# Altium project M.2 Accelerator.PrjPcb (part 2 of 2)

## Sheet 6_DRAMBanks.SchDoc: DRAM Signals (Banks 34-35)
size Legal; Date: 12/28/2025; Author: Praveen Perera; DrawnBy: Praveen Perera; Engineer: Praveen Perera; Revision: 1; SheetNumber: 6; SheetTotal: 9
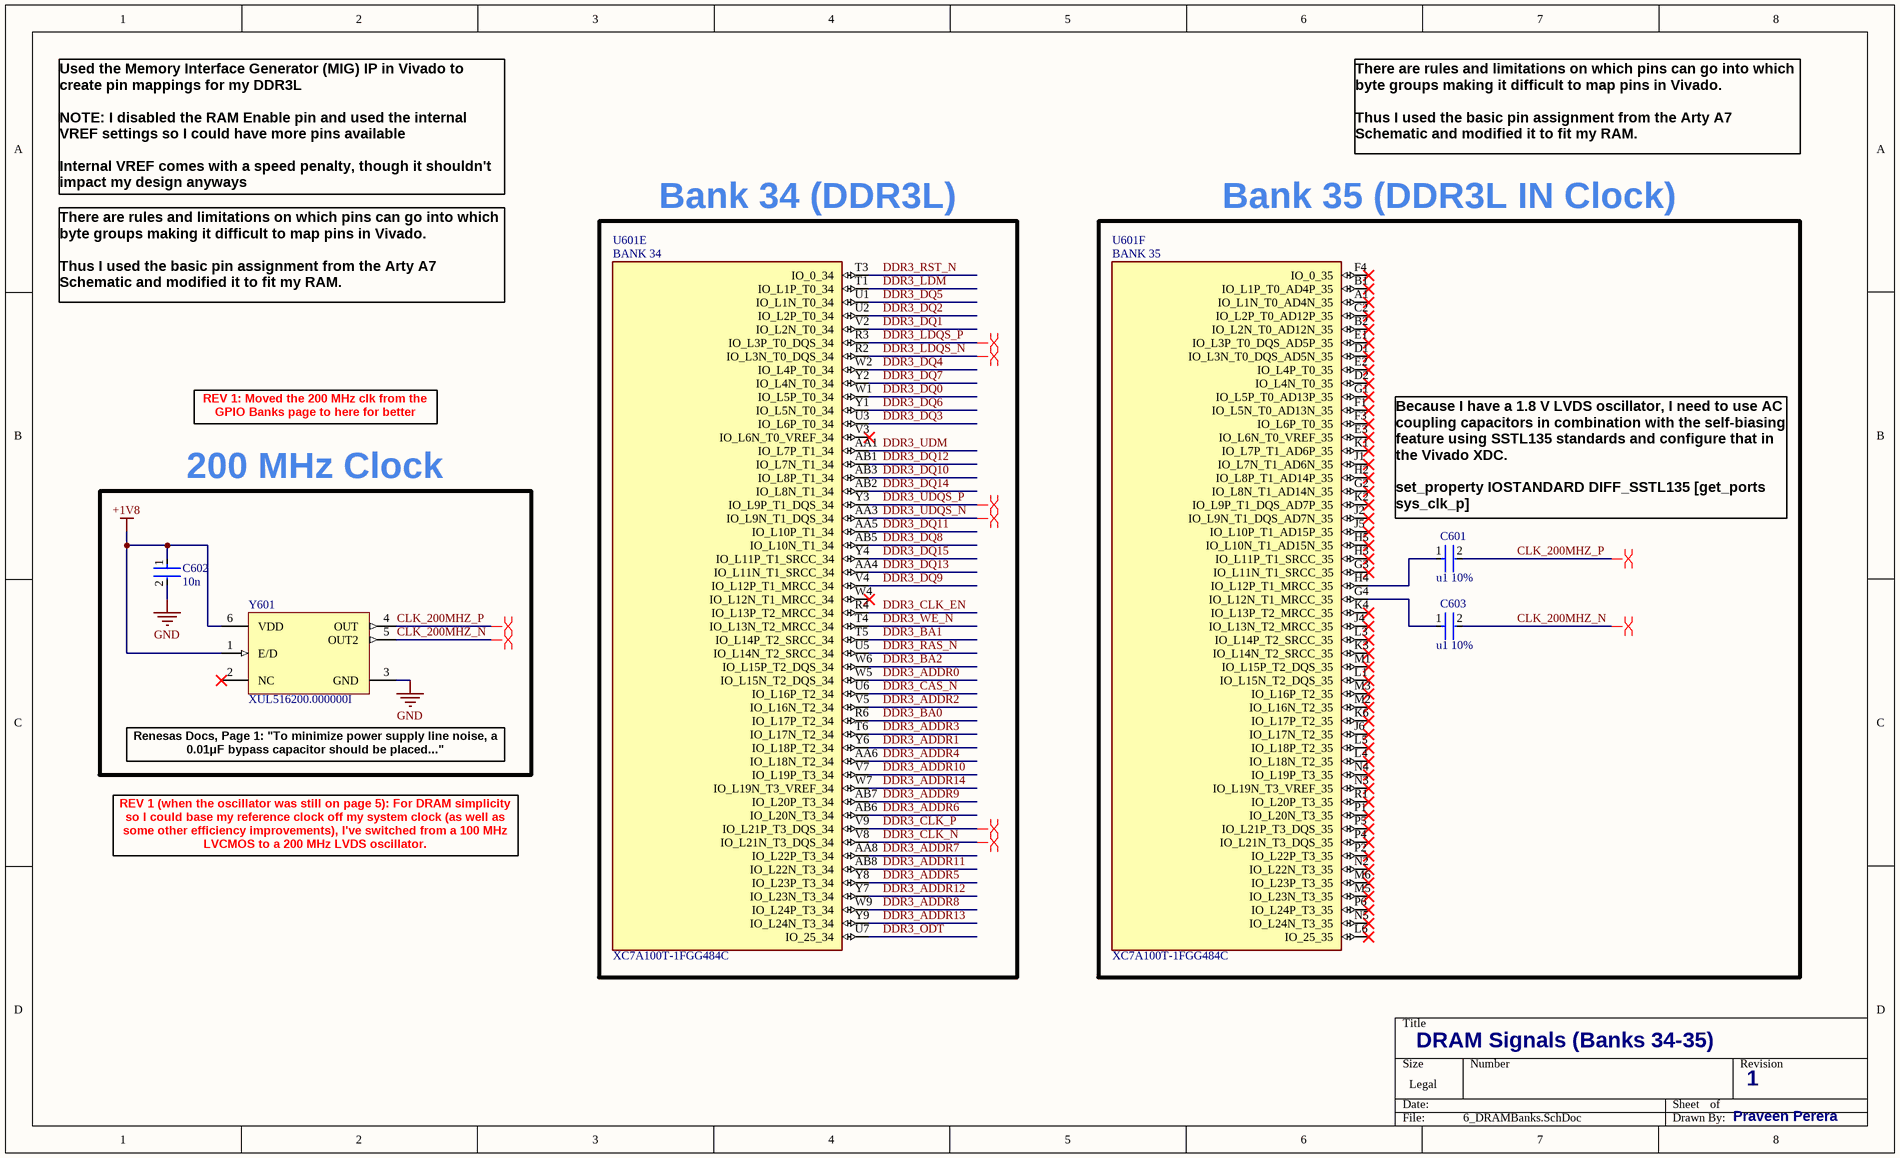
[diagram p5: 6_DRAMBanks.SchDoc]

### Parts
C601  u1 10%  [FP-CL891-IPC_C]
C602  10n  [FP-GCM155-0_05-IPC_C]
C603  u1 10%  [FP-CL891-IPC_C]
U601  XC7A100T-1FGG484C  [BGA484C100P22X22_2300X2300X260N]  (parts E,F of 14)
Y601  XUL516200.000000I  [JS6_MFG]

### Nets
+1V8: C602.1 Y601.1(E/D) Y601.6(VDD)
GND: C602.2 Y601.3(GND)  [project net BUCK_1V_EPAD]
CLK_200MHZ_N: C603.2 Y601.5(OUT2)
CLK_200MHZ_P: C601.2 Y601.4(OUT)
DDR3_ADDR0: U601.W5(IO_L15N_T2_DQS_34)
DDR3_ADDR1: U601.Y6(IO_L18P_T2_34)
DDR3_ADDR2: U601.V5(IO_L16N_T2_34)
DDR3_ADDR3: U601.T6(IO_L17N_T2_34)
DDR3_ADDR4: U601.AA6(IO_L18N_T2_34)
DDR3_ADDR5: U601.Y8(IO_L23P_T3_34)
DDR3_ADDR6: U601.AB6(IO_L20N_T3_34)
DDR3_ADDR7: U601.AA8(IO_L22P_T3_34)
DDR3_ADDR8: U601.W9(IO_L24P_T3_34)
DDR3_ADDR9: U601.AB7(IO_L20P_T3_34)
DDR3_ADDR10: U601.V7(IO_L19P_T3_34)
DDR3_ADDR11: U601.AB8(IO_L22N_T3_34)
DDR3_ADDR12: U601.Y7(IO_L23N_T3_34)
DDR3_ADDR13: U601.Y9(IO_L24N_T3_34)
DDR3_ADDR14: U601.W7(IO_L19N_T3_VREF_34)
DDR3_BA0: U601.R6(IO_L17P_T2_34)
DDR3_BA1: U601.T5(IO_L14P_T2_SRCC_34)
DDR3_BA2: U601.W6(IO_L15P_T2_DQS_34)
DDR3_CAS_N: U601.U6(IO_L16P_T2_34)
DDR3_CLK_EN: U601.R4(IO_L13P_T2_MRCC_34)
DDR3_CLK_N: U601.V8(IO_L21N_T3_DQS_34)
DDR3_CLK_P: U601.V9(IO_L21P_T3_DQS_34)
DDR3_DQ0: U601.W1(IO_L5P_T0_34)
DDR3_DQ1: U601.V2(IO_L2N_T0_34)
DDR3_DQ2: U601.U2(IO_L2P_T0_34)
DDR3_DQ3: U601.U3(IO_L6P_T0_34)
DDR3_DQ4: U601.W2(IO_L4P_T0_34)
DDR3_DQ5: U601.U1(IO_L1N_T0_34)
DDR3_DQ6: U601.Y1(IO_L5N_T0_34)
DDR3_DQ7: U601.Y2(IO_L4N_T0_34)
DDR3_DQ8: U601.AB5(IO_L10N_T1_34)
DDR3_DQ9: U601.V4(IO_L12P_T1_MRCC_34)
DDR3_DQ10: U601.AB3(IO_L8P_T1_34)
DDR3_DQ11: U601.AA5(IO_L10P_T1_34)
DDR3_DQ12: U601.AB1(IO_L7N_T1_34)
DDR3_DQ13: U601.AA4(IO_L11N_T1_SRCC_34)
DDR3_DQ14: U601.AB2(IO_L8N_T1_34)
DDR3_DQ15: U601.Y4(IO_L11P_T1_SRCC_34)
DDR3_LDM: U601.T1(IO_L1P_T0_34)
DDR3_LDQS_N: U601.R2(IO_L3N_T0_DQS_34)
DDR3_LDQS_P: U601.R3(IO_L3P_T0_DQS_34)
DDR3_ODT: U601.U7(IO_25_34)
DDR3_RAS_N: U601.U5(IO_L14N_T2_SRCC_34)
DDR3_RST_N: U601.T3(IO_0_34)
DDR3_UDM: U601.AA1(IO_L7P_T1_34)
DDR3_UDQS_N: U601.AA3(IO_L9N_T1_DQS_34)
DDR3_UDQS_P: U601.Y3(IO_L9P_T1_DQS_34)
DDR3_WE_N: U601.T4(IO_L13N_T2_MRCC_34)
NetC601_1: C601.1 U601.H4(IO_L12P_T1_MRCC_35)
NetC603_1: C603.1 U601.G4(IO_L12N_T1_MRCC_35)

Not connected (* = marked no-connect by the designer): U601 A1(IO_L1N_T0_AD4N_35)* B1(IO_L1P_T0_AD4P_35)* B2(IO_L2N_T0_AD12N_35)* C2(IO_L2P_T0_AD12P_35)* D1(IO_L3N_T0_DQS_AD5N_35)* D2(IO_L4N_T0_35)* E1(IO_L3P_T0_DQS_AD5P_35)* E2(IO_L4P_T0_35)* E3(IO_L6N_T0_VREF_35)* F1(IO_L5N_T0_AD13N_35)* F3(IO_L6P_T0_35)* F4(IO_0_35)* G1(IO_L5P_T0_AD13P_35)* G2(IO_L8N_T1_AD14N_35)* G3(IO_L11N_T1_SRCC_35)* H2(IO_L8P_T1_AD14P_35)* H3(IO_L11P_T1_SRCC_35)* H5(IO_L10N_T1_AD15N_35)* J1(IO_L7N_T1_AD6N_35)* J2(IO_L9N_T1_DQS_AD7N_35)* J4(IO_L13N_T2_MRCC_35)* J5(IO_L10P_T1_AD15P_35)* J6(IO_L17N_T2_35)* K1(IO_L7P_T1_AD6P_35)* K2(IO_L9P_T1_DQS_AD7P_35)* K3(IO_L14N_T2_SRCC_35)* K4(IO_L13P_T2_MRCC_35)* K6(IO_L17P_T2_35)* L1(IO_L15N_T2_DQS_35)* L3(IO_L14P_T2_SRCC_35)* L4(IO_L18N_T2_35)* L5(IO_L18P_T2_35)* L6(IO_25_35)* M1(IO_L15P_T2_DQS_35)* M2(IO_L16N_T2_35)* M3(IO_L16P_T2_35)* M5(IO_L23N_T3_35)* M6(IO_L23P_T3_35)* N2(IO_L22N_T3_35)* N3(IO_L19N_T3_VREF_35)* N4(IO_L19P_T3_35)* N5(IO_L24N_T3_35)* P1(IO_L20N_T3_35)* P2(IO_L22P_T3_35)* P4(IO_L21N_T3_DQS_35)* P5(IO_L21P_T3_DQS_35)* P6(IO_L24P_T3_35)* R1(IO_L20P_T3_35)* V3(IO_L6N_T0_VREF_34)* W4(IO_L12N_T1_MRCC_34)*; Y601 2(NC)*

### Layout directives
differential pair: CLK_200MHZ_N, CLK_200MHZ_P, DDR3_CLK_N, DDR3_CLK_P, DDR3_LDQS_N, DDR3_LDQS_P, DDR3_UDQS_N, DDR3_UDQS_P

### Notes on the sheet
- There are rules and limitations on which pins can go into which byte groups making it difficult to map pins in Vivado.
  Thus I used the basic pin assignment from the Arty A7 Schematic and modified it to fit my RAM.
- Used the Memory Interface Generator (MIG) IP in Vivado to create pin mappings for my DDR3L
  NOTE: I disabled the RAM Enable pin and used the internal VREF settings so I could have more pins available
  Internal VREF comes with a speed penalty, though it shouldn't impact my design anyways
- Bank 34 (DDR3L)
- Bank 35 (DDR3L IN Clock)
- REV 1: Moved the 200 MHz clk from the GPIO Banks page to here for better organization.
- 200 MHz Clock
- Because I have a 1.8 V LVDS oscillator, I need to use AC coupling capacitors in combination with the self-biasing feature using SSTL135 standards and configure that in the Vivado XDC.
  set_property IOSTANDARD DIFF_SSTL135 [get_ports sys_clk_p]
  set_property DIFF_TERM TRUE [get_ports sys_clk_p]
- (near Y601) Renesas Docs, Page 1: "To minimize power supply line noise, a 0.01μF bypass capacitor should be placed..."
- REV 1 (when the oscillator was still on page 5): For DRAM simplicity so I could base my reference clock off my system clock (as well as some other efficiency improvements), I've switched from a 100 MHz LVCMOS to a 200 MHz LVDS oscillator.
- (in symbol XC7A100T-1FGG484C, part E) BANK 34
- (in symbol XC7A100T-1FGG484C, part F) BANK 35

### Library data of the parts
C601 C603 = CMP-13271-001945-1: as C303 on sheet 3_PowerDistribution
C602 = CMP-2008-03715-2: GCM155R71E103KA37D / Ceramic Capacitor for Automotive 10nF ±10% 25VDC X7R 0402 Paper T/R; Voltage Rating (DC): 25V; Packaging: Tape and Reel; Case/Package: 0402; Max Operating Temperature: 125°C; Radiation Hardening: No; Case Code (Metric): 1005; Termination: SMD/SMT; Mount: Surface Mount; Voltage: 25V; Width: 0.02inch; Dielectric: X7R; Height: 0.5mm; Depth: 0.5mm; Length: 1mm; Package Quantity: 1; Thickness: 0.022inch; Voltage Rating: 25V; Case Code (Imperial): 0402; Ratings: AEC-Q200; Capacitance: 10nF; REACH SVHC: No SVHC; Lead Free: Lead Free; Min Operating Temperature: -55°C; Tolerance: 10%
U601 = XC7A100T-1FGG484C: Artix-7 Field Programmable Gate Array (FPGA) IC 285 4976640 101440 484-BBGA; MF: Xilinx Inc.; Value: *; Check_prices: https://www.snapeda.com/parts/XC7A100T-1FGG484C/Xilinx/view-part/?ref=eda; MP: XC7A100T-1FGG484C; SnapEDA_Link: https://www.snapeda.com/parts/XC7A100T-1FGG484C/Xilinx/view-part/?ref=snap; Package: FBGA-484 Xilinx
Y601 = CMP-00572-107107086-3: Crystal Oscillator 200MHz LVDS 1.8VDC ±25ppm ‐40 to +85°C 4-Pin SMD 5x3.2mm Cut Tape; Min Input Voltage: 1.71V; Max Output Frequency: 999.9MHz; Max Input Voltage: 1.89V; ComponentLink1URL: http://www.renesas.com; ComponentLink2URL: https://octopart.com/cad-content/api/get-model-datasheet/15189/107107086; HelpURL: https://octopart.com/cad-content/api/get-model-datasheet/15189/107107086; ComponentLink3Description: Manufacturer's Package Drawing; Mount: Surface Mount; Number of Pins: 6; Min Operating Temperature: -40°C; Case/Package: CLCC; Height: 1.2mm; ComponentLink2Description: Datasheet URL; ComponentLink1Description: Manufacturer's Website; ComponentLink3URL: https://www.renesas.com/en/document/psc/js6-package-outline-50-x-32-mm-body-11-mm-thick; Max Operating Temperature: 85°C; RoHS: Compliant; Output Type: LVDS

## Sheet 7_DDR3L.SchDoc: DDR3L Configuration
size Legal; Date: 12/28/2025; Author: Praveen Perera; DrawnBy: Praveen Perera; Engineer: Praveen Perera; Revision: 0; SheetNumber: 7; SheetTotal: 9
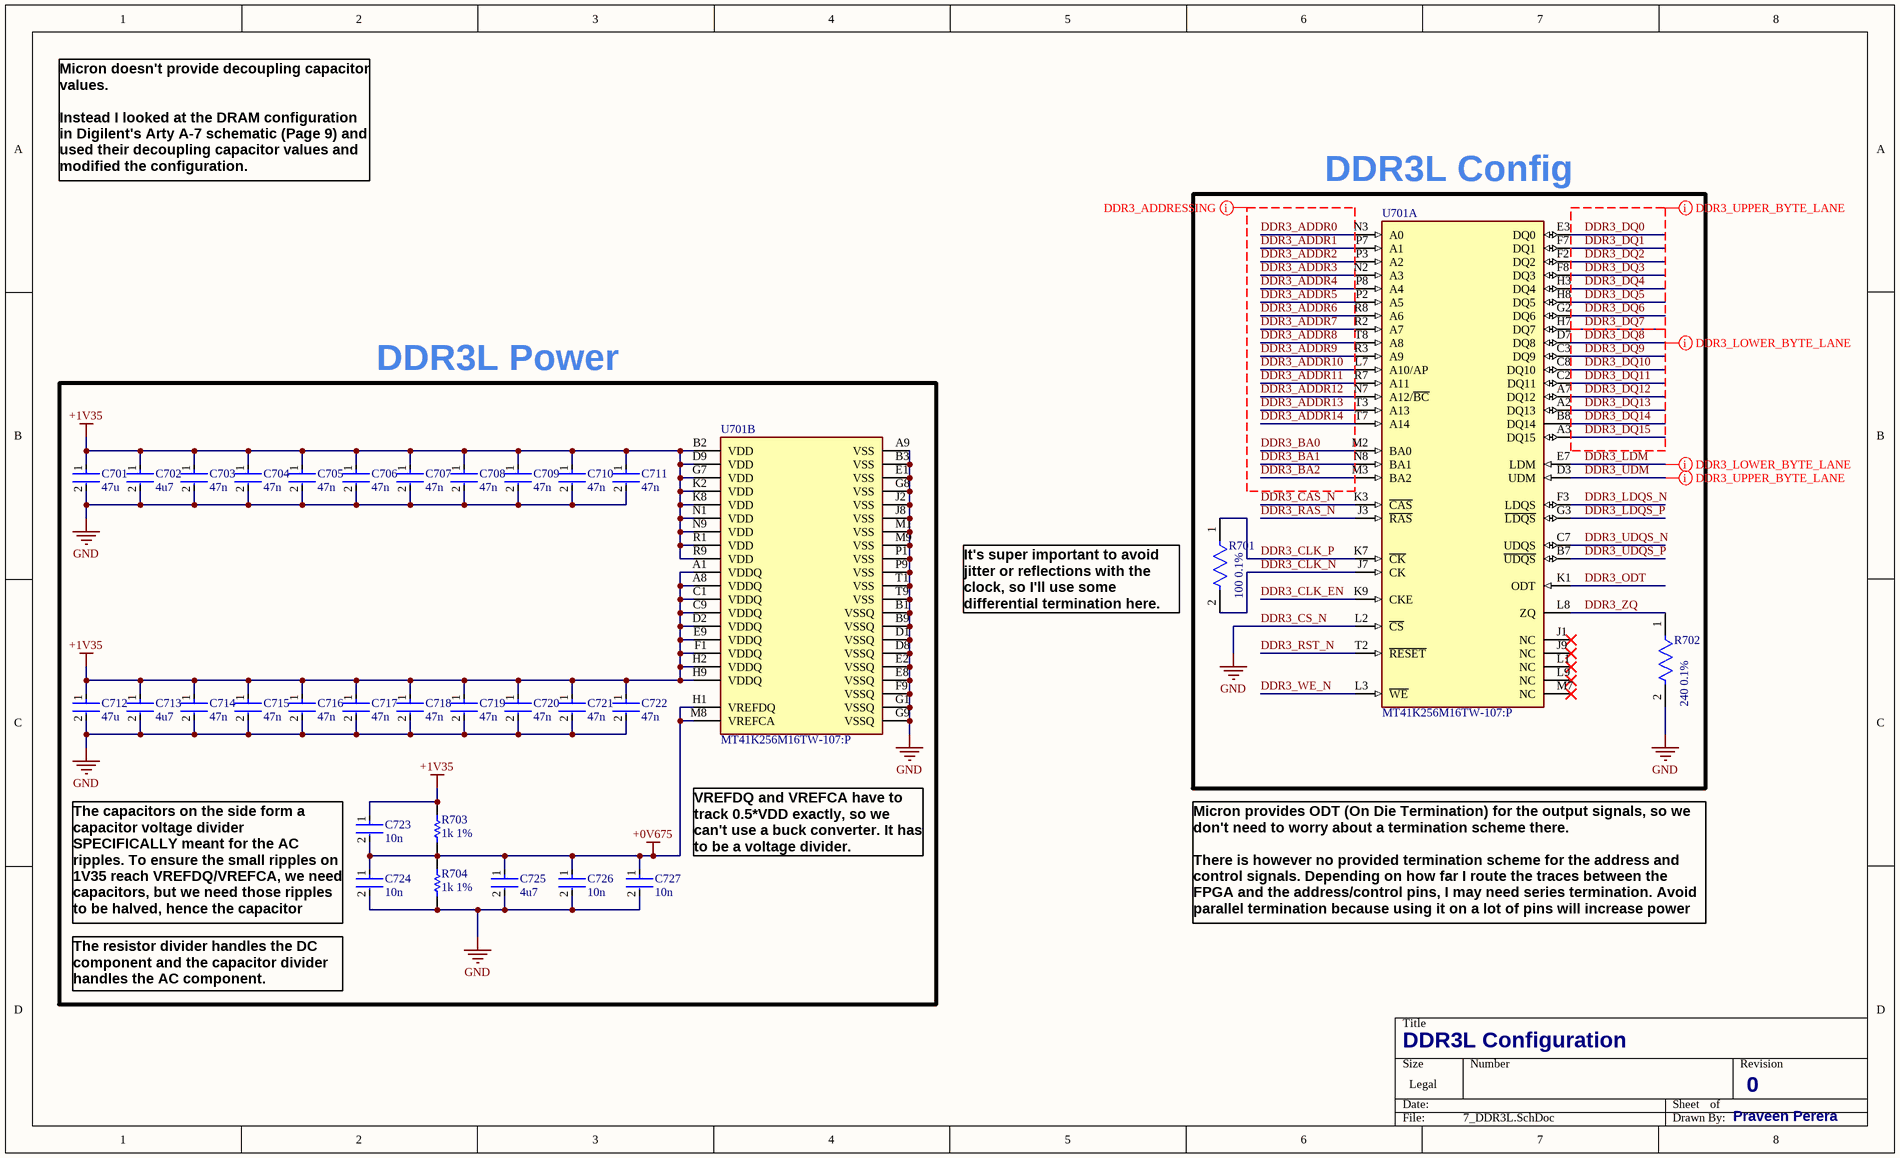
[diagram p6: 7_DDR3L.SchDoc]

### Parts
C701  47u  [FP-GRM188-0_2-IPC_B]
C702  4u7  [FP-CL829-IPC_C]
C703  47n  [FP-C0603-030-0_03-IPC_A]
C704  47n  [FP-C0603-030-0_03-IPC_A]
C705  47n  [FP-C0603-030-0_03-IPC_A]
C706  47n  [FP-C0603-030-0_03-IPC_A]
C707  47n  [FP-C0603-030-0_03-IPC_A]
C708  47n  [FP-C0603-030-0_03-IPC_A]
C709  47n  [FP-C0603-030-0_03-IPC_A]
C710  47n  [FP-C0603-030-0_03-IPC_A]
C711  47n  [FP-C0603-030-0_03-IPC_A]
C712  47u  [FP-GRM188-0_2-IPC_B]
C713  4u7  [FP-CL829-IPC_C]
C714  47n  [FP-C0603-030-0_03-IPC_A]
C715  47n  [FP-C0603-030-0_03-IPC_A]
C716  47n  [FP-C0603-030-0_03-IPC_A]
C717  47n  [FP-C0603-030-0_03-IPC_A]
C718  47n  [FP-C0603-030-0_03-IPC_A]
C719  47n  [FP-C0603-030-0_03-IPC_A]
C720  47n  [FP-C0603-030-0_03-IPC_A]
C721  47n  [FP-C0603-030-0_03-IPC_A]
C722  47n  [FP-C0603-030-0_03-IPC_A]
C723  10n  [FP-GCM155-0_05-IPC_C]
C724  10n  [FP-GCM155-0_05-IPC_C]
C725  4u7  [FP-CL829-IPC_C]
C726  10n  [FP-GCM155-0_05-IPC_C]
C727  10n  [FP-GCM155-0_05-IPC_C]
R701  100 0.1%  [FP-ERA1A-IPC_B]
R702  240 0.1%  [FP-RT0201-MFG]
R703  1k 1%  [RESC0603X28X15NL05T05]
R704  1k 1%  [RESC0603X28X15NL05T05]
U701  MT41K256M16TW-107:P  [FP-TW-IPC_C]  (parts A,B of 2)

### Nets
+0V675: C723.2 C724.1 C725.1 C726.1 C727.1 R703.1 R704.2 U701.H1(VREFDQ) U701.M8(VREFCA)
+1V35: C701.1 C702.1 C703.1 C704.1 C705.1 C706.1 C707.1 C708.1 C709.1 C710.1 C711.1 C712.1 C713.1 C714.1 C715.1 C716.1 C717.1 C718.1 C719.1 C720.1 C721.1 C722.1 C723.1 R703.2 U701.A1(VDDQ) U701.A8(VDDQ) U701.B2(VDD) U701.C1(VDDQ) U701.C9(VDDQ) U701.D2(VDDQ) U701.D9(VDD) U701.E9(VDDQ) U701.F1(VDDQ) U701.G7(VDD) U701.H2(VDDQ) U701.H9(VDDQ) U701.K2(VDD) U701.K8(VDD) U701.N1(VDD) U701.N9(VDD) U701.R1(VDD) U701.R9(VDD)
DDR3_CS_N: C701.2 C702.2 C703.2 C704.2 C705.2 C706.2 C707.2 C708.2 C709.2 C710.2 C711.2 C712.2 C713.2 C714.2 C715.2 C716.2 C717.2 C718.2 C719.2 C720.2 C721.2 C722.2 C724.2 C725.2 C726.2 C727.2 R702.2 R704.1 U701.A9(VSS) U701.B1(VSSQ) U701.B3(VSS) U701.B9(VSSQ) U701.D1(VSSQ) U701.D8(VSSQ) U701.E1(VSS) U701.E2(VSSQ) U701.E8(VSSQ) U701.F9(VSSQ) U701.G1(VSSQ) U701.G8(VSS) U701.G9(VSSQ) U701.J2(VSS) U701.J8(VSS) U701.L2(~{CS}) U701.M1(VSS) U701.M9(VSS) U701.P1(VSS) U701.P9(VSS) U701.T1(VSS) U701.T9(VSS)  [also labelled GND]  [project net BUCK_1V_EPAD]
DDR3_ADDR0: U701.N3(A0)
DDR3_ADDR1: U701.P7(A1)
DDR3_ADDR2: U701.P3(A2)
DDR3_ADDR3: U701.N2(A3)
DDR3_ADDR4: U701.P8(A4)
DDR3_ADDR5: U701.P2(A5)
DDR3_ADDR6: U701.R8(A6)
DDR3_ADDR7: U701.R2(A7)
DDR3_ADDR8: U701.T8(A8)
DDR3_ADDR9: U701.R3(A9)
DDR3_ADDR10: U701.L7(A10/AP)
DDR3_ADDR11: U701.R7(A11)
DDR3_ADDR12: U701.N7(A12/~{BC})
DDR3_ADDR13: U701.T3(A13)
DDR3_ADDR14: U701.T7(A14)
DDR3_BA0: U701.M2(BA0)
DDR3_BA1: U701.N8(BA1)
DDR3_BA2: U701.M3(BA2)
DDR3_CAS_N: U701.K3(~{CAS})
DDR3_CLK_EN: U701.K9(CKE)
DDR3_CLK_N: R701.2 U701.J7(CK)
DDR3_CLK_P: R701.1 U701.K7(~{CK})
DDR3_DQ0: U701.E3(DQ0)
DDR3_DQ1: U701.F7(DQ1)
DDR3_DQ2: U701.F2(DQ2)
DDR3_DQ3: U701.F8(DQ3)
DDR3_DQ4: U701.H3(DQ4)
DDR3_DQ5: U701.H8(DQ5)
DDR3_DQ6: U701.G2(DQ6)
DDR3_DQ7: U701.H7(DQ7)
DDR3_DQ8: U701.D7(DQ8)
DDR3_DQ9: U701.C3(DQ9)
DDR3_DQ10: U701.C8(DQ10)
DDR3_DQ11: U701.C2(DQ11)
DDR3_DQ12: U701.A7(DQ12)
DDR3_DQ13: U701.A2(DQ13)
DDR3_DQ14: U701.B8(DQ14)
DDR3_DQ15: U701.A3(DQ15)
DDR3_LDM: U701.E7(LDM)
DDR3_LDQS_N: U701.F3(LDQS)
DDR3_LDQS_P: U701.G3(~{LDQS})
DDR3_ODT: U701.K1(ODT)
DDR3_RAS_N: U701.J3(~{RAS})
DDR3_RST_N: U701.T2(~{RESET})
DDR3_UDM: U701.D3(UDM)
DDR3_UDQS_N: U701.C7(UDQS)
DDR3_UDQS_P: U701.B7(~{UDQS})
DDR3_WE_N: U701.L3(~{WE})
DDR3_ZQ: R702.1 U701.L8(ZQ)

Not connected (* = marked no-connect by the designer): U701 J1(NC)* J9(NC)* L1(NC)* L9(NC)* M7(NC)*

### Layout directives
mark named DDR3_ADDRESSING: DDR3_ADDR0, DDR3_ADDR1, DDR3_ADDR2, DDR3_ADDR3, DDR3_ADDR4, DDR3_ADDR5, DDR3_ADDR6, DDR3_ADDR7, DDR3_ADDR8, DDR3_ADDR9, DDR3_ADDR10, DDR3_ADDR11, DDR3_ADDR12, DDR3_ADDR13, DDR3_ADDR14, DDR3_BA0, DDR3_BA1, DDR3_BA2
mark named DDR3_UPPER_BYTE_LANE: DDR3_DQ0, DDR3_DQ1, DDR3_DQ2, DDR3_DQ3, DDR3_DQ4, DDR3_DQ5, DDR3_DQ6, DDR3_DQ7, DDR3_UDM
mark named DDR3_LOWER_BYTE_LANE: DDR3_DQ8, DDR3_LDM

### Notes on the sheet
- Micron doesn't provide decoupling capacitor values.
  Instead I looked at the DRAM configuration in Digilent's Arty A-7 schematic (Page 9) and used their decoupling capacitor values and modified the configuration.
- (near U701) DDR3L Config
- DDR3L Power
- (near R701) It's super important to avoid jitter or reflections with the clock, so I'll use some differential termination here.
- VREFDQ and VREFCA have to track 0.5*VDD exactly, so we can't use a buck converter. It has to be a voltage divider.
- The capacitors on the side form a capacitor voltage divider SPECIFICALLY meant for the AC ripples. To ensure the small ripples on 1V35 reach VREFDQ/VREFCA, we need capacitors, but we need those ripples to be halved, hence the capacitor divider.
- Micron provides ODT (On Die Termination) for the output signals, so we don't need to worry about a termination scheme there.
  There is however no provided termination scheme for the address and control signals. Depending on how far I route the traces between the FPGA and the address/control pins, I may need series termination. Avoid parallel termination because using it on a lot of pins will increase power draw.
- The resistor divider handles the DC component and the capacitor divider handles the AC component.

### Library data of the parts
C701 C712 = CMP-2000-05444-2: GRM188R60J476ME15D / Chip Multilayer Ceramic Capacitors for General Purpose, 0603, 47uF, X5R, 15%, 20%, 6.3V; Voltage Rating (DC): 6.3V; Thickness: 0.039inch; Case Code (Imperial): 0603; Packaging: Tape and Reel; Capacitance: 47uF; Width: 0.031inch; Dielectric: X5R; Max Operating Temperature: 85°C; Mount: Surface Mount; Case Code (Metric): 1608; Length: 0.063inch; Voltage Rating: 6.3V; Tolerance: 20%; Case/Package: 0603; Min Operating Temperature: -55°C
C702 C713 C725 = CMP-13271-001468-1: as C312 on sheet 3_PowerDistribution; Mount: Surface Mount; Case Code (Metric): 1005; Case/Package: 0402; Length: 0.039inch; Capacitance: 4.7uF; Voltage Rating: 16V; Max Operating Temperature: 85°C; Tolerance: 20%; Thickness: 0.022inch; Min Operating Temperature: -55°C; Case Code (Imperial): 0402; Packaging: Tape and Reel; Width: 0.02inch
C703-C711 C714-C722 = CMP-08246-004548-1: C0603X5R1E473K030BB / Multilayer Ceramic Capacitors 47nF ±10% 25V X5R SMD 0201; Min Operating Temperature: -55°C; Case Code (Imperial): 0201; Termination: SMD/SMT; Voltage Rating (DC): 25V; Max Operating Temperature: 85°C; Case Code (Metric): 0603; Dielectric: X5R; Voltage Rating: 25V; RoHS Compliant: Yes; Thickness: 0.013inch; Length: 0.024inch; Dielectric Material: Ceramic; Width: 0.3mm; Capacitance: 47nF; Case/Package: 0201; Series: C; Tolerance: 10%; Packaging: Tape and Reel; Weight: 6E-06oz; Height: 0.3mm; Package Quantity: 15000; Mount: Surface Mount; Lead Free: Lead Free
C723 C724 C726 C727 = CMP-2008-03715-2: as C602 on sheet 6_DRAMBanks; Packaging: Tape and Reel; Case/Package: 0402; Max Operating Temperature: 125°C; Radiation Hardening: No; Case Code (Metric): 1005; Termination: SMD/SMT; Mount: Surface Mount; Voltage: 25V; Width: 0.02inch; Dielectric: X7R; Height: 0.5mm; Depth: 0.5mm; Length: 1mm; Package Quantity: 1; Thickness: 0.022inch; Voltage Rating: 25V; Case Code (Imperial): 0402; Ratings: AEC-Q200; Capacitance: 10nF; REACH SVHC: No SVHC; Lead Free: Lead Free; Min Operating Temperature: -55°C; Tolerance: 10%
R701 = CMP-05422-000095-1: ERA-1AEB101C / RES SMD 100 OHM 0.1% 1/20W 0201; Max Power Dissipation: 50mW; Resistance: 100R; Temperature Coefficient: 25ppm/°C; Lead Free: Lead Free; Width: 0.012inch; Max Operating Temperature: 155°C; Features: Automotive AEC-Q200; Packaging: Tape and Reel; Length: 0.024inch; Number of Terminations: 2; Case Code (Imperial): 0201; Case/Package: 0201; Case Code (Metric): 0603; Tolerance: 0.1%; Min Operating Temperature: -55°C; Height: 0.009inch; Resistor Type: Thin Film
R702 = CMP-03412-015201-1: RT0201BRD07240RL / RT0201 240Ω 0.05W 25 ppm/°C 0.10%; Manufacturer: Yageo; Tolerance: 0.001; Voltage Rating: 25V; Temperature Coefficient: 25 ppm/°C; RoHS: TRUE; Temperature Range High: +125°C; Footprint Url: http://www.yageo.com/exep/pages/download/literatures/PYu-R_Mount_10.pdf; Octopart: https://octopart.com/rt0201brd07240rl-yageo-87214234; Device Class L1: Passive Components; Manufacturer Part Number: RT0201BRD07240RL; Device Class L3: Chip SMD Resistors; Series: RT; Automotive: No; Ipc Land Pattern Name: RESC6030X23; Composition: Thin Film; Value: 240Ω; Power Rating: 0.05W; Temperature Range Low: -55°C; Category: Res; Lead Free: Yes; Resistance: 240Ω; Temperature: -55°C to +125°C; Device Class L2: Resistors; ComponentLink2URL: http://www.yageo.com/documents/recent/PYu-RT_1-to-0.01_RoHS_L_9.pdf; ComponentLink2Description: Datasheet; Package: RT0201; Height: 0.26mm
R703 R704 = CMP-2004-00208-1: CRCW02011K00FKED; Manufacturer: Vishay Dale; Part Number: CRCW02011K00FKED
U701 = CMP-2000-07475-2: IC DRAM 4G PARALLEL 96FBGA; Manufacturer: Micron; Access Time: 1.07ns; Nominal Supply Current: 12-156mA; Min Supply Voltage: 1.283V; Memory Type: SDRAM,DDR3; Standoff Height: 0.29mm; Max Supply Voltage: 1.45V; Memory Size: 4Gbits; Device Class L1: Integrated Circuits (ICs); Lead Free: Yes; ComponentLink2Description: Datasheet; Manufacturer Part Number: MT41K256M16TW-107:P; Category: IC; Digikey Description: IC DRAM 4G PARALLEL 96FBGA; Device Class L3: RAM; Interface: Parallel; RoHS: TRUE; Octopart: https://octopart.com/mt41k256m16tw-107%3Ap-micron-66533852; Temperature Range High: +85°C; ComponentLink2URL: https://www.micron.com/-/media/client/global/documents/products/data-sheet/dram/ddr3/4gb_ddr3l.pdf; Temperature: 0°C to +85°C; Package: TW; Device Class L2: Memory; Automotive: No; Height: 1.2mm; Temperature Range Low: 0°C

## Sheet 8_MGTBank.SchDoc: MGT Configuration
size A; Date: 12/29/25; Author: Praveen Perera; DrawnBy: Praveen Perera; Engineer: Praveen Perera; Revision: 0; SheetNumber: 8; SheetTotal: 9
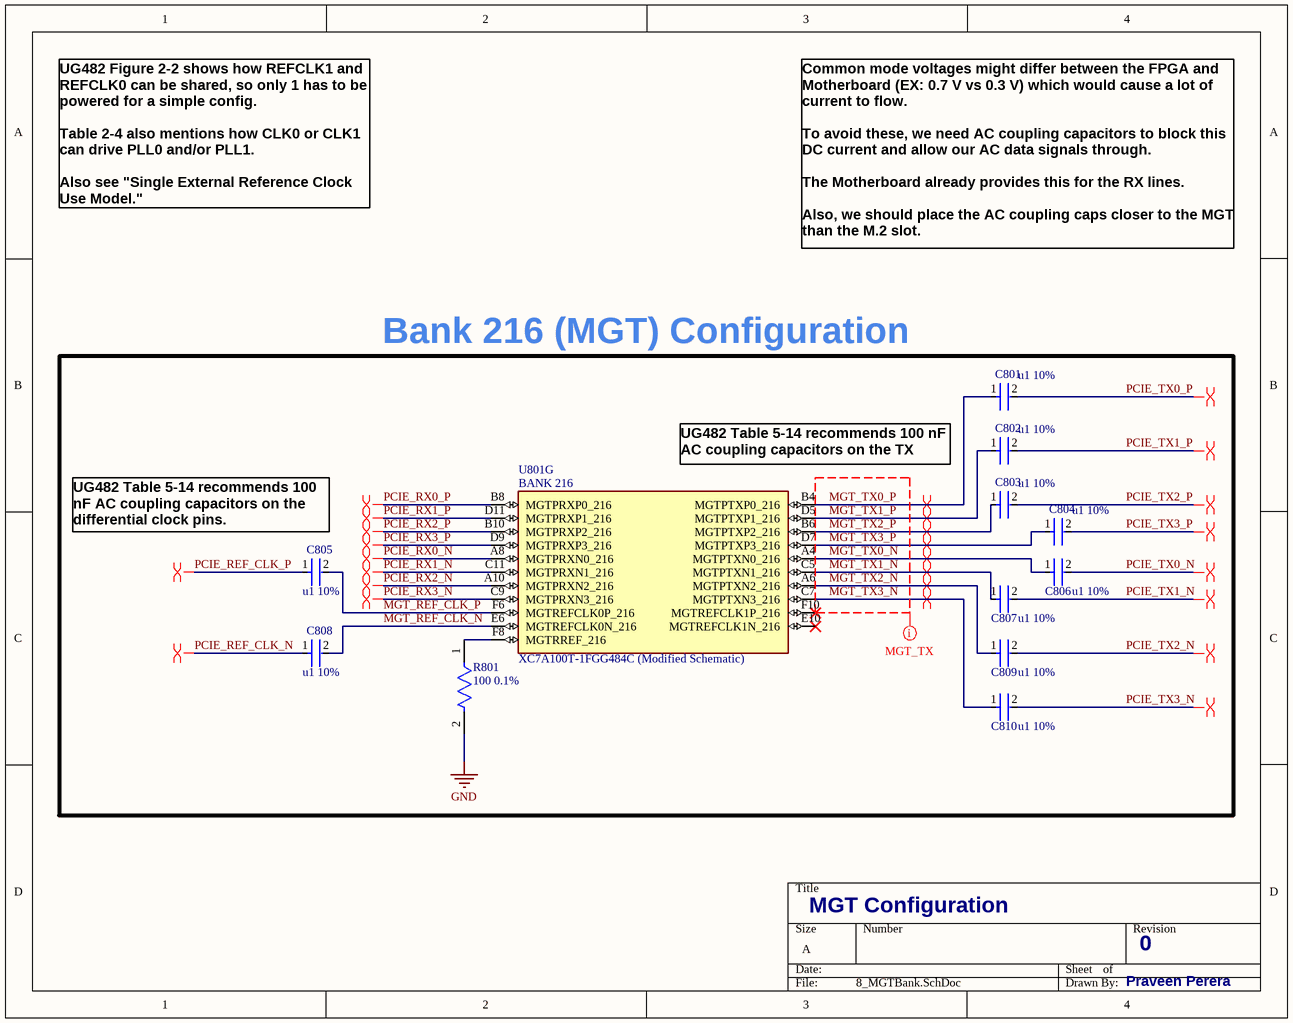
[diagram p7: 8_MGTBank.SchDoc]

### Parts
C801  u1 10%  [FP-CL891-IPC_C]
C802  u1 10%  [FP-CL891-IPC_C]
C803  u1 10%  [FP-CL891-IPC_C]
C804  u1 10%  [FP-CL891-IPC_C]
C805  u1 10%  [FP-CL891-IPC_C]
C806  u1 10%  [FP-CL891-IPC_C]
C807  u1 10%  [FP-CL891-IPC_C]
C808  u1 10%  [FP-CL891-IPC_C]
C809  u1 10%  [FP-CL891-IPC_C]
C810  u1 10%  [FP-CL891-IPC_C]
R801  100 0.1%  [FP-ERA1A-IPC_B]
U801  XC7A100T-1FGG484C (Modified Schematic)  [BGA484C100P22X22_2300X2300X260N]  (part G of 14)

### Nets
GND: R801.2  [project net BUCK_1V_EPAD]
MGT_REF_CLK_N: C808.2 U801.E6(MGTREFCLK0N_216)
MGT_REF_CLK_P: C805.2 U801.F6(MGTREFCLK0P_216)
MGT_TX0_N: C806.1 U801.A4(MGTPTXN0_216)
MGT_TX0_P: C801.1 U801.B4(MGTPTXP0_216)
MGT_TX1_N: C807.1 U801.C5(MGTPTXN1_216)
MGT_TX1_P: C802.1 U801.D5(MGTPTXP1_216)
MGT_TX2_N: C809.1 U801.A6(MGTPTXN2_216)
MGT_TX2_P: C803.1 U801.B6(MGTPTXP2_216)
MGT_TX3_N: C810.1 U801.C7(MGTPTXN3_216)
MGT_TX3_P: C804.1 U801.D7(MGTPTXP3_216)
PCIE_REF_CLK_N: C808.1
PCIE_REF_CLK_P: C805.1
PCIE_RX0_N: U801.A8(MGTPRXN0_216)
PCIE_RX0_P: U801.B8(MGTPRXP0_216)
PCIE_RX1_N: U801.C11(MGTPRXN1_216)
PCIE_RX1_P: U801.D11(MGTPRXP1_216)
PCIE_RX2_N: U801.A10(MGTPRXN2_216)
PCIE_RX2_P: U801.B10(MGTPRXP2_216)
PCIE_RX3_N: U801.C9(MGTPRXN3_216)
PCIE_RX3_P: U801.D9(MGTPRXP3_216)
PCIE_TX0_N: C806.2
PCIE_TX0_P: C801.2
PCIE_TX1_N: C807.2
PCIE_TX1_P: C802.2
PCIE_TX2_N: C809.2
PCIE_TX2_P: C803.2
PCIE_TX3_N: C810.2
PCIE_TX3_P: C804.2
NetR801_1: R801.1 U801.F8(MGTRREF_216)

Not connected (* = marked no-connect by the designer): U801 E10(MGTREFCLK1N_216)* F10(MGTREFCLK1P_216)*

### Layout directives
differential pair: MGT_TX0_N, MGT_TX0_P, MGT_TX1_N, MGT_TX1_P, MGT_TX2_N, MGT_TX2_P, MGT_TX3_N, MGT_TX3_P, PCIE_REF_CLK_N, PCIE_REF_CLK_P, PCIE_RX0_N, PCIE_RX0_P, PCIE_RX1_N, PCIE_RX1_P, PCIE_RX2_N, PCIE_RX2_P, PCIE_RX3_N, PCIE_RX3_P, PCIE_TX0_N, PCIE_TX0_P, PCIE_TX1_N, PCIE_TX1_P, PCIE_TX2_N, PCIE_TX2_P, PCIE_TX3_N, PCIE_TX3_P
mark named MGT_TX: MGT_TX0_N, MGT_TX0_P, MGT_TX1_N, MGT_TX1_P, MGT_TX2_N, MGT_TX2_P, MGT_TX3_N, MGT_TX3_P

### Notes on the sheet
- UG482 Figure 2-2 shows how REFCLK1 and REFCLK0 can be shared, so only 1 has to be powered for a simple config.
  Table 2-4 also mentions how CLK0 or CLK1 can drive PLL0 and/or PLL1.
  Also see "Single External Reference Clock Use Model."
- Common mode voltages might differ between the FPGA and Motherboard (EX: 0.7 V vs 0.3 V) which would cause a lot of current to flow.
  To avoid these, we need AC coupling capacitors to block this DC current and allow our AC data signals through.
  The Motherboard already provides this for the RX lines.
  Also, we should place the AC coupling caps closer to the MGT than the M.2 slot.
- (near C801) Bank 216 (MGT) Configuration
- UG482 Table 5-14 recommends 100 nF AC coupling capacitors on the TX pins.
- (near C805) UG482 Table 5-14 recommends 100 nF AC coupling capacitors on the differential clock pins.
- (in symbol CMP-002-000007-2, part G) BANK 216

### Library data of the parts
C801-C810 = CMP-13271-001945-1: as C303 on sheet 3_PowerDistribution
R801 = CMP-05422-000095-1: as R701 on sheet 7_DDR3L; Lead Free: Lead Free; Width: 0.012inch; Max Operating Temperature: 155°C; Features: Automotive AEC-Q200; Packaging: Tape and Reel; Length: 0.024inch; Number of Terminations: 2; Case Code (Imperial): 0201; Case/Package: 0201; Case Code (Metric): 0603; Tolerance: 0.1%; Min Operating Temperature: -55°C; Height: 0.009inch; Resistor Type: Thin Film
U801 = CMP-002-000007-2: Artix-7 Field Programmable Gate Array (FPGA) IC 285 4976640 101440 484-BBGA; MF: Xilinx Inc.; Check_prices: https://www.snapeda.com/parts/XC7A100T-1FGG484C/Xilinx/view-part/?ref=eda; Source: XC7A100T-1FGG484C - Modified.SchLib; MP: XC7A100T-1FGG484C; Pin Count: 484; Package: FBGA-484 Xilinx; Component Type: Standard; SnapEDA_Link: https://www.snapeda.com/parts/XC7A100T-1FGG484C/Xilinx/view-part/?ref=snap; Design Item ID: XC7A100T-1FGG484C; Value: *

## Sheet 9_M.2_B+M.SchDoc: M.2 M-Key Configuration
size A; Date: 12/29/25; Author: Praveen Perera; DrawnBy: Praveen Perera; Engineer: Praveen Perera; Revision: 0; SheetNumber: 9; SheetTotal: 9
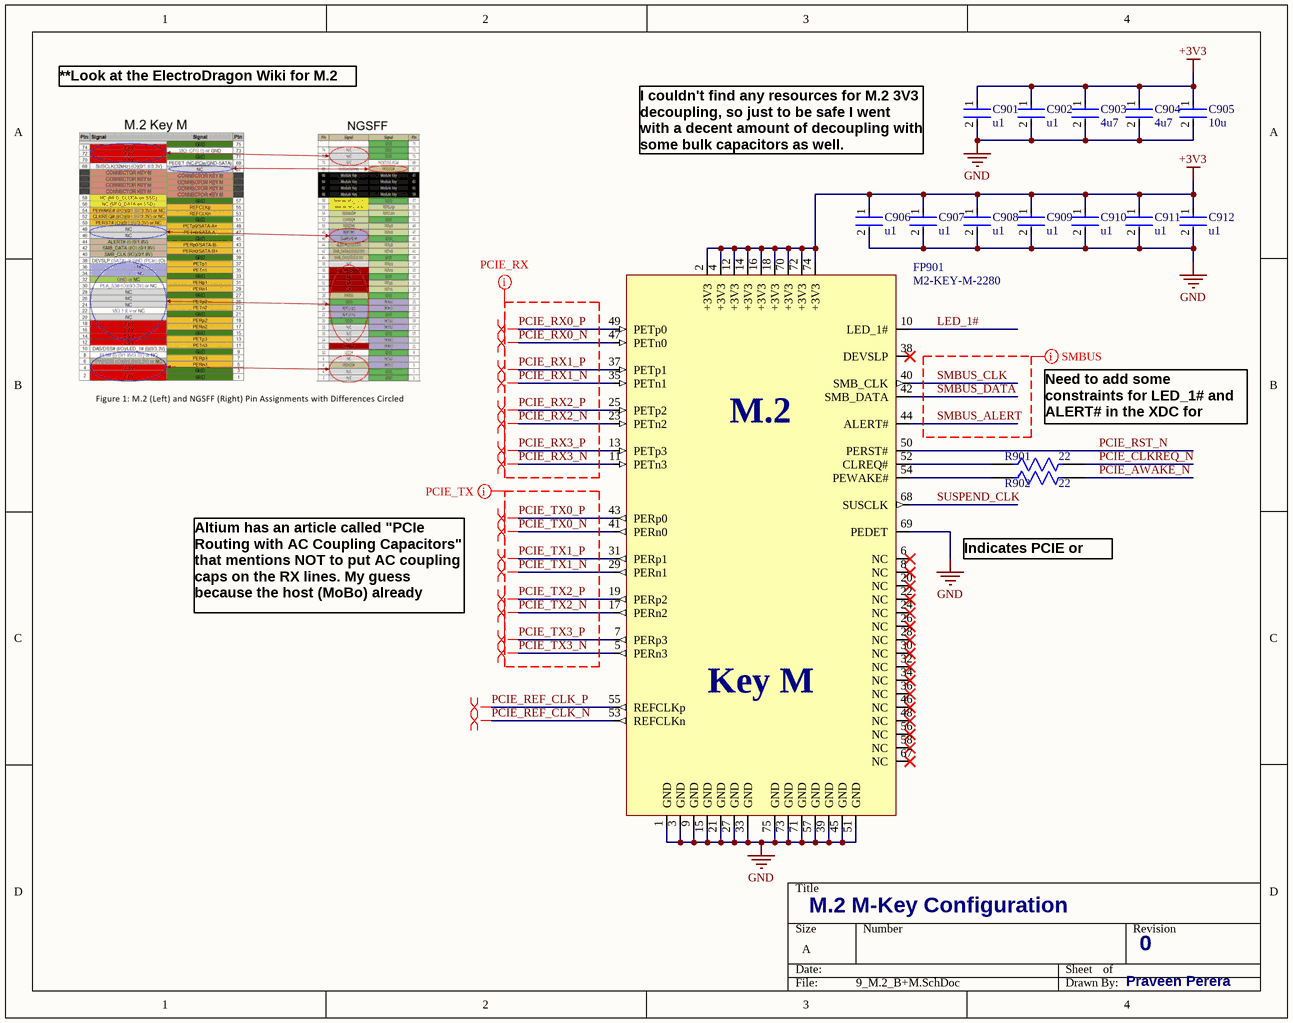
[diagram p8: 9_M.2_B+M.SchDoc]

### Parts
C901  u1  [FP-CL891-IPC_C]
C902  u1  [FP-CL891-IPC_C]
C903  4u7  [FP-CL829-IPC_C]
C904  4u7  [FP-CL829-IPC_C]
C905  10u  [FP-CL05A106MP5NUNC-MFG]
C906  u1  [FP-CL891-IPC_C]
C907  u1  [FP-CL891-IPC_C]
C908  u1  [FP-CL891-IPC_C]
C909  u1  [FP-CL891-IPC_C]
C910  u1  [FP-CL891-IPC_C]
C911  u1  [FP-CL891-IPC_C]
C912  u1  [FP-CL891-IPC_C]
FP901  M2-KEY-M-2280  [M2-KEY-M-2280]  (no BOM)
R901  22  [FP-RMCF0201-IPC_C]
R902  22  [FP-RMCF0201-IPC_C]

### Nets
+3V3: C901.1 C902.1 C903.1 C904.1 C905.1 C906.1 C907.1 C908.1 C909.1 C910.1 C911.1 C912.1 FP901.2(+3V3) FP901.4(+3V3) FP901.12(+3V3) FP901.14(+3V3) FP901.16(+3V3) FP901.18(+3V3) FP901.70(+3V3) FP901.72(+3V3) FP901.74(+3V3)  [project net BUCK_1V_MODE]
GND: C901.2 C902.2 C903.2 C904.2 C905.2 C906.2 C907.2 C908.2 C909.2 C910.2 C911.2 C912.2 FP901.1(GND) FP901.3(GND) FP901.9(GND) FP901.15(GND) FP901.21(GND) FP901.27(GND) FP901.33(GND) FP901.39(GND) FP901.45(GND) FP901.51(GND) FP901.57(GND) FP901.69(PEDET) FP901.71(GND) FP901.73(GND) FP901.75(GND)  [project net BUCK_1V_EPAD]
LED_1#: FP901.10(LED_1#)
PCIE_AWAKE_N: R902.2
PCIE_CLKREQ_N: R901.2
PCIE_REF_CLK_N: FP901.53(REFCLKn)
PCIE_REF_CLK_P: FP901.55(REFCLKp)
PCIE_RST_N: FP901.50(PERST#)
PCIE_RX0_N: FP901.47(PETn0)
PCIE_RX0_P: FP901.49(PETp0)
PCIE_RX1_N: FP901.35(PETn1)
PCIE_RX1_P: FP901.37(PETp1)
PCIE_RX2_N: FP901.23(PETn2)
PCIE_RX2_P: FP901.25(PETp2)
PCIE_RX3_N: FP901.11(PETn3)
PCIE_RX3_P: FP901.13(PETp3)
PCIE_TX0_N: FP901.41(PERn0)
PCIE_TX0_P: FP901.43(PERp0)
PCIE_TX1_N: FP901.29(PERn1)
PCIE_TX1_P: FP901.31(PERp1)
PCIE_TX2_N: FP901.17(PERn2)
PCIE_TX2_P: FP901.19(PERp2)
PCIE_TX3_N: FP901.5(PERn3)
PCIE_TX3_P: FP901.7(PERp3)
SMBUS_ALERT: FP901.44(ALERT#)
SMBUS_CLK: FP901.40(SMB_CLK)
SMBUS_DATA: FP901.42(SMB_DATA)
SUSPEND_CLK: FP901.68(SUSCLK)
NetFP901_52: FP901.52(CLREQ#) R901.1
NetFP901_54: FP901.54(PEWAKE#) R902.1

Not connected (* = marked no-connect by the designer): FP901 6(NC)* 8(NC)* 20(NC)* 22(NC)* 24(NC)* 26(NC)* 28(NC)* 30(NC)* 32(NC)* 34(NC)* 36(NC)* 38(DEVSLP)* 46(NC)* 48(NC)* 56(NC)* 58(NC)* 67(NC)*

### Layout directives
differential pair: PCIE_REF_CLK_N, PCIE_REF_CLK_P, PCIE_RX0_N, PCIE_RX0_P, PCIE_RX1_N, PCIE_RX1_P, PCIE_RX2_N, PCIE_RX2_P, PCIE_RX3_N, PCIE_RX3_P, PCIE_TX0_N, PCIE_TX0_P, PCIE_TX1_N, PCIE_TX1_P, PCIE_TX2_N, PCIE_TX2_P, PCIE_TX3_N, PCIE_TX3_P
mark named SMBUS: SMBUS_ALERT, SMBUS_CLK, SMBUS_DATA
mark named PCIE_RX: PCIE_RX0_N, PCIE_RX0_P, PCIE_RX1_N, PCIE_RX1_P, PCIE_RX2_N, PCIE_RX2_P, PCIE_RX3_N, PCIE_RX3_P
mark named PCIE_TX: PCIE_TX0_N, PCIE_TX0_P, PCIE_TX1_N, PCIE_TX1_P, PCIE_TX2_N, PCIE_TX2_P, PCIE_TX3_N, PCIE_TX3_P

### Notes on the sheet
- **Look at the ElectroDragon Wiki for M.2 pins
- I couldn't find any resources for M.2 3V3 decoupling, so just to be safe I went with a decent amount of decoupling with some bulk capacitors as well.
- Need to add some constraints for LED_1# and ALERT# in the XDC for safety
- Indicates PCIE or SATA
- Altium has an article called "PCIe Routing with AC Coupling Capacitors" that mentions NOT to put AC coupling caps on the RX lines. My guess because the host (MoBo) already provides them.
- (in symbol CMP-028-000000-1) M.2; Key M

### Library data of the parts
C901 C902 C906-C912 = CMP-13271-001945-1: CL05B104KB5NNNC / Cap Ceramic 100nF 50V X7R ±10% SMD 0402 +125°C Paper T/R
C903 C904 = CMP-13271-001468-1: CL05A475MO5NUNC / Cap Ceramic 4.7uF 16V X5R ±20% SMD 0402 +85°C Paper T/R; Mount: Surface Mount; Case Code (Metric): 1005; Case/Package: 0402; Length: 0.039inch; Capacitance: 4.7uF; Voltage Rating: 16V; Max Operating Temperature: 85°C; Tolerance: 20%; Thickness: 0.022inch; Min Operating Temperature: -55°C; Case Code (Imperial): 0402; Packaging: Tape and Reel; Width: 0.02inch
C905 = CMP-13271-000002-1: CL05A106MP5NUNC / CAP CER 10UF 10V X5R 0402; Manufacturer: Samsung; Temperature Coefficient: 15%; Tolerance: 20%; Material: Ceramic; Octopart: https://octopart.com/cl05a106mp5nunc-samsung-22457395; Voltage Rating: 10V; RoHS: TRUE; Value: 10uF; Height: 0.7mm; Digikey Description: CAP CER 10UF 10V X5R 0402; Automotive: No; Package: CL05A106MP5NUNC; Device Class L1: Passive Components; Capacitance: 10uF; Temperature Range High: +85°C; ComponentLink2Description: Datasheet; Device Class L2: Capacitors; Temperature Characteristic: X5R; Manufacturer Part Number: CL05A106MP5NUNC; Temperature: -55°C to +85°C; ComponentLink2URL: http://www.samsungsem.com/kr/support/product-search/mlcc/__icsFiles/afieldfile/2019/05/10/19-CL05A106MP5NUNC.pdf; Device Class L3: Ceramic Capacitors; Category: Cap; Temperature Range Low: -55°C; Ipc Land Pattern Name: CAPC10050X50; Lead Free: Yes
FP901 = CMP-028-000000-1: M.2 Key M 22mm x 80mm; Component Type: Standard (No BOM); Design Item ID: M2-KEY-M-2280; Source: M2_2280_MKey.SchLib; Pin Count: 67
R901 R902 = CMP-26527-003623-1: RMCF0201JG22R0 / 22Ω ±5% 0.05W 0201 Thick Film Chip Resistor AEC-Q200 compliant; Max Power Dissipation: 50mW; Resistance: 22R; Temperature Coefficient: 200ppm/°C; Length: 0.024inch; Height: 0.009inch; Max Operating Temperature: 125°C; Packaging: Tape and Reel; Number of Terminations: 2; Case/Package: 0201; Resistor Type: Thick Film; Width: 0.012inch; Case Code (Metric): 0603; Min Operating Temperature: -55°C; Case Code (Imperial): 0201; Tolerance: 5%

## Nets that join several sheets
+1V: 2_PowerRails (5 pins), 3_PowerDistribution (37 pins)
+1V2: 2_PowerRails (5 pins), 3_PowerDistribution (9 pins)
+1V8: 2_PowerRails (C205.1 C206.1 L202.2 R204.1), 3_PowerDistribution (16 pins), 6_DRAMBanks (C602.1 Y601.1 Y601.6)
+1V25: 2_PowerRails (C217.1 C218.1 L205.2 R215.1), 4_Configuration (C401.1 C402.1 U401.M10)
+1V35: 2_PowerRails (C214.1 C215.1 L204.2 R210.1), 3_PowerDistribution (26 pins), 7_DDR3L (42 pins)
BUCK_1V_EPAD: 2_PowerRails (24 pins), 3_PowerDistribution (166 pins), 4_Configuration (10 pins), 5_GPIOBanks (R506.1), 6_DRAMBanks (C602.2 Y601.3), 7_DDR3L (50 pins), 8_MGTBank (R801.2), 9_M.2_B+M (27 pins)
BUCK_1V_MODE: 2_PowerRails (22 pins), 3_PowerDistribution (54 pins), 4_Configuration (13 pins), 5_GPIOBanks (6 pins), 9_M.2_B+M (21 pins)
DDR3_ADDR0: 6_DRAMBanks (U601.W5), 7_DDR3L (U701.N3)
DDR3_ADDR1: 6_DRAMBanks (U601.Y6), 7_DDR3L (U701.P7)
DDR3_ADDR2: 6_DRAMBanks (U601.V5), 7_DDR3L (U701.P3)
DDR3_ADDR3: 6_DRAMBanks (U601.T6), 7_DDR3L (U701.N2)
DDR3_ADDR4: 6_DRAMBanks (U601.AA6), 7_DDR3L (U701.P8)
DDR3_ADDR5: 6_DRAMBanks (U601.Y8), 7_DDR3L (U701.P2)
DDR3_ADDR6: 6_DRAMBanks (U601.AB6), 7_DDR3L (U701.R8)
DDR3_ADDR7: 6_DRAMBanks (U601.AA8), 7_DDR3L (U701.R2)
DDR3_ADDR8: 6_DRAMBanks (U601.W9), 7_DDR3L (U701.T8)
DDR3_ADDR9: 6_DRAMBanks (U601.AB7), 7_DDR3L (U701.R3)
DDR3_ADDR10: 6_DRAMBanks (U601.V7), 7_DDR3L (U701.L7)
DDR3_ADDR11: 6_DRAMBanks (U601.AB8), 7_DDR3L (U701.R7)
DDR3_ADDR12: 6_DRAMBanks (U601.Y7), 7_DDR3L (U701.N7)
DDR3_ADDR13: 6_DRAMBanks (U601.Y9), 7_DDR3L (U701.T3)
DDR3_ADDR14: 6_DRAMBanks (U601.W7), 7_DDR3L (U701.T7)
DDR3_BA0: 6_DRAMBanks (U601.R6), 7_DDR3L (U701.M2)
DDR3_BA1: 6_DRAMBanks (U601.T5), 7_DDR3L (U701.N8)
DDR3_BA2: 6_DRAMBanks (U601.W6), 7_DDR3L (U701.M3)
DDR3_CAS_N: 6_DRAMBanks (U601.U6), 7_DDR3L (U701.K3)
DDR3_CLK_EN: 6_DRAMBanks (U601.R4), 7_DDR3L (U701.K9)
DDR3_CLK_N: 6_DRAMBanks (U601.V8), 7_DDR3L (R701.2 U701.J7)
DDR3_CLK_P: 6_DRAMBanks (U601.V9), 7_DDR3L (R701.1 U701.K7)
DDR3_DQ0: 6_DRAMBanks (U601.W1), 7_DDR3L (U701.E3)
DDR3_DQ1: 6_DRAMBanks (U601.V2), 7_DDR3L (U701.F7)
DDR3_DQ2: 6_DRAMBanks (U601.U2), 7_DDR3L (U701.F2)
DDR3_DQ3: 6_DRAMBanks (U601.U3), 7_DDR3L (U701.F8)
DDR3_DQ4: 6_DRAMBanks (U601.W2), 7_DDR3L (U701.H3)
DDR3_DQ5: 6_DRAMBanks (U601.U1), 7_DDR3L (U701.H8)
DDR3_DQ6: 6_DRAMBanks (U601.Y1), 7_DDR3L (U701.G2)
DDR3_DQ7: 6_DRAMBanks (U601.Y2), 7_DDR3L (U701.H7)
DDR3_DQ8: 6_DRAMBanks (U601.AB5), 7_DDR3L (U701.D7)
DDR3_DQ9: 6_DRAMBanks (U601.V4), 7_DDR3L (U701.C3)
DDR3_DQ10: 6_DRAMBanks (U601.AB3), 7_DDR3L (U701.C8)
DDR3_DQ11: 6_DRAMBanks (U601.AA5), 7_DDR3L (U701.C2)
DDR3_DQ12: 6_DRAMBanks (U601.AB1), 7_DDR3L (U701.A7)
DDR3_DQ13: 6_DRAMBanks (U601.AA4), 7_DDR3L (U701.A2)
DDR3_DQ14: 6_DRAMBanks (U601.AB2), 7_DDR3L (U701.B8)
DDR3_DQ15: 6_DRAMBanks (U601.Y4), 7_DDR3L (U701.A3)
DDR3_LDM: 6_DRAMBanks (U601.T1), 7_DDR3L (U701.E7)
DDR3_LDQS_N: 6_DRAMBanks (U601.R2), 7_DDR3L (U701.F3)
DDR3_LDQS_P: 6_DRAMBanks (U601.R3), 7_DDR3L (U701.G3)
DDR3_ODT: 6_DRAMBanks (U601.U7), 7_DDR3L (U701.K1)
DDR3_RAS_N: 6_DRAMBanks (U601.U5), 7_DDR3L (U701.J3)
DDR3_RST_N: 6_DRAMBanks (U601.T3), 7_DDR3L (U701.T2)
DDR3_UDM: 6_DRAMBanks (U601.AA1), 7_DDR3L (U701.D3)
DDR3_UDQS_N: 6_DRAMBanks (U601.AA3), 7_DDR3L (U701.C7)
DDR3_UDQS_P: 6_DRAMBanks (U601.Y3), 7_DDR3L (U701.B7)
DDR3_WE_N: 6_DRAMBanks (U601.T4), 7_DDR3L (U701.L3)
LED_1#: 5_GPIOBanks (D501.1 U501.N15), 9_M.2_B+M (FP901.10)
PCIE_AWAKE_N: 5_GPIOBanks (R505.1 R506.2 U501.V19), 9_M.2_B+M (R902.2)
PCIE_CLKREQ_N: 5_GPIOBanks (U501.Y19), 9_M.2_B+M (R901.2)
PCIE_REF_CLK_N: 8_MGTBank (C808.1), 9_M.2_B+M (FP901.53)
PCIE_REF_CLK_P: 8_MGTBank (C805.1), 9_M.2_B+M (FP901.55)
PCIE_RST_N: 5_GPIOBanks (U501.V18), 9_M.2_B+M (FP901.50)
PCIE_RX0_N: 8_MGTBank (U801.A8), 9_M.2_B+M (FP901.47)
PCIE_RX0_P: 8_MGTBank (U801.B8), 9_M.2_B+M (FP901.49)
PCIE_RX1_N: 8_MGTBank (U801.C11), 9_M.2_B+M (FP901.35)
PCIE_RX1_P: 8_MGTBank (U801.D11), 9_M.2_B+M (FP901.37)
PCIE_RX2_N: 8_MGTBank (U801.A10), 9_M.2_B+M (FP901.23)
PCIE_RX2_P: 8_MGTBank (U801.B10), 9_M.2_B+M (FP901.25)
PCIE_RX3_N: 8_MGTBank (U801.C9), 9_M.2_B+M (FP901.11)
PCIE_RX3_P: 8_MGTBank (U801.D9), 9_M.2_B+M (FP901.13)
PCIE_TX0_N: 8_MGTBank (C806.2), 9_M.2_B+M (FP901.41)
PCIE_TX0_P: 8_MGTBank (C801.2), 9_M.2_B+M (FP901.43)
PCIE_TX1_N: 8_MGTBank (C807.2), 9_M.2_B+M (FP901.29)
PCIE_TX1_P: 8_MGTBank (C802.2), 9_M.2_B+M (FP901.31)
PCIE_TX2_N: 8_MGTBank (C809.2), 9_M.2_B+M (FP901.17)
PCIE_TX2_P: 8_MGTBank (C803.2), 9_M.2_B+M (FP901.19)
PCIE_TX3_N: 8_MGTBank (C810.2), 9_M.2_B+M (FP901.5)
PCIE_TX3_P: 8_MGTBank (C804.2), 9_M.2_B+M (FP901.7)
QSPI_CS_N: 4_Configuration (R413.2 U404.7), 5_GPIOBanks (U501.T19)
QSPI_DQ0: 4_Configuration (U404.15), 5_GPIOBanks (U501.P22)
QSPI_DQ1: 4_Configuration (U404.8), 5_GPIOBanks (U501.R22)
QSPI_DQ2: 4_Configuration (R411.2 U404.9), 5_GPIOBanks (U501.P21)
QSPI_DQ3: 4_Configuration (R412.2 U404.1), 5_GPIOBanks (U501.R21)
QSPI_RST_N: 4_Configuration (U404.3), 5_GPIOBanks (U501.R19)
SMBUS_ALERT: 5_GPIOBanks (R504.1 U501.Y22), 9_M.2_B+M (FP901.44)
SMBUS_CLK: 5_GPIOBanks (R502.1 U501.AA21), 9_M.2_B+M (FP901.40)
SMBUS_DATA: 5_GPIOBanks (R503.1 U501.Y21), 9_M.2_B+M (FP901.42)
SUSPEND_CLK: 5_GPIOBanks (U501.Y18), 9_M.2_B+M (FP901.68)
XADCGND: 3_PowerDistribution (C331.2 FB302.1 U301.K9), 4_Configuration (5 pins)